# EAGLE design tube_clock_shield_v1 (EAGLE 6.3)
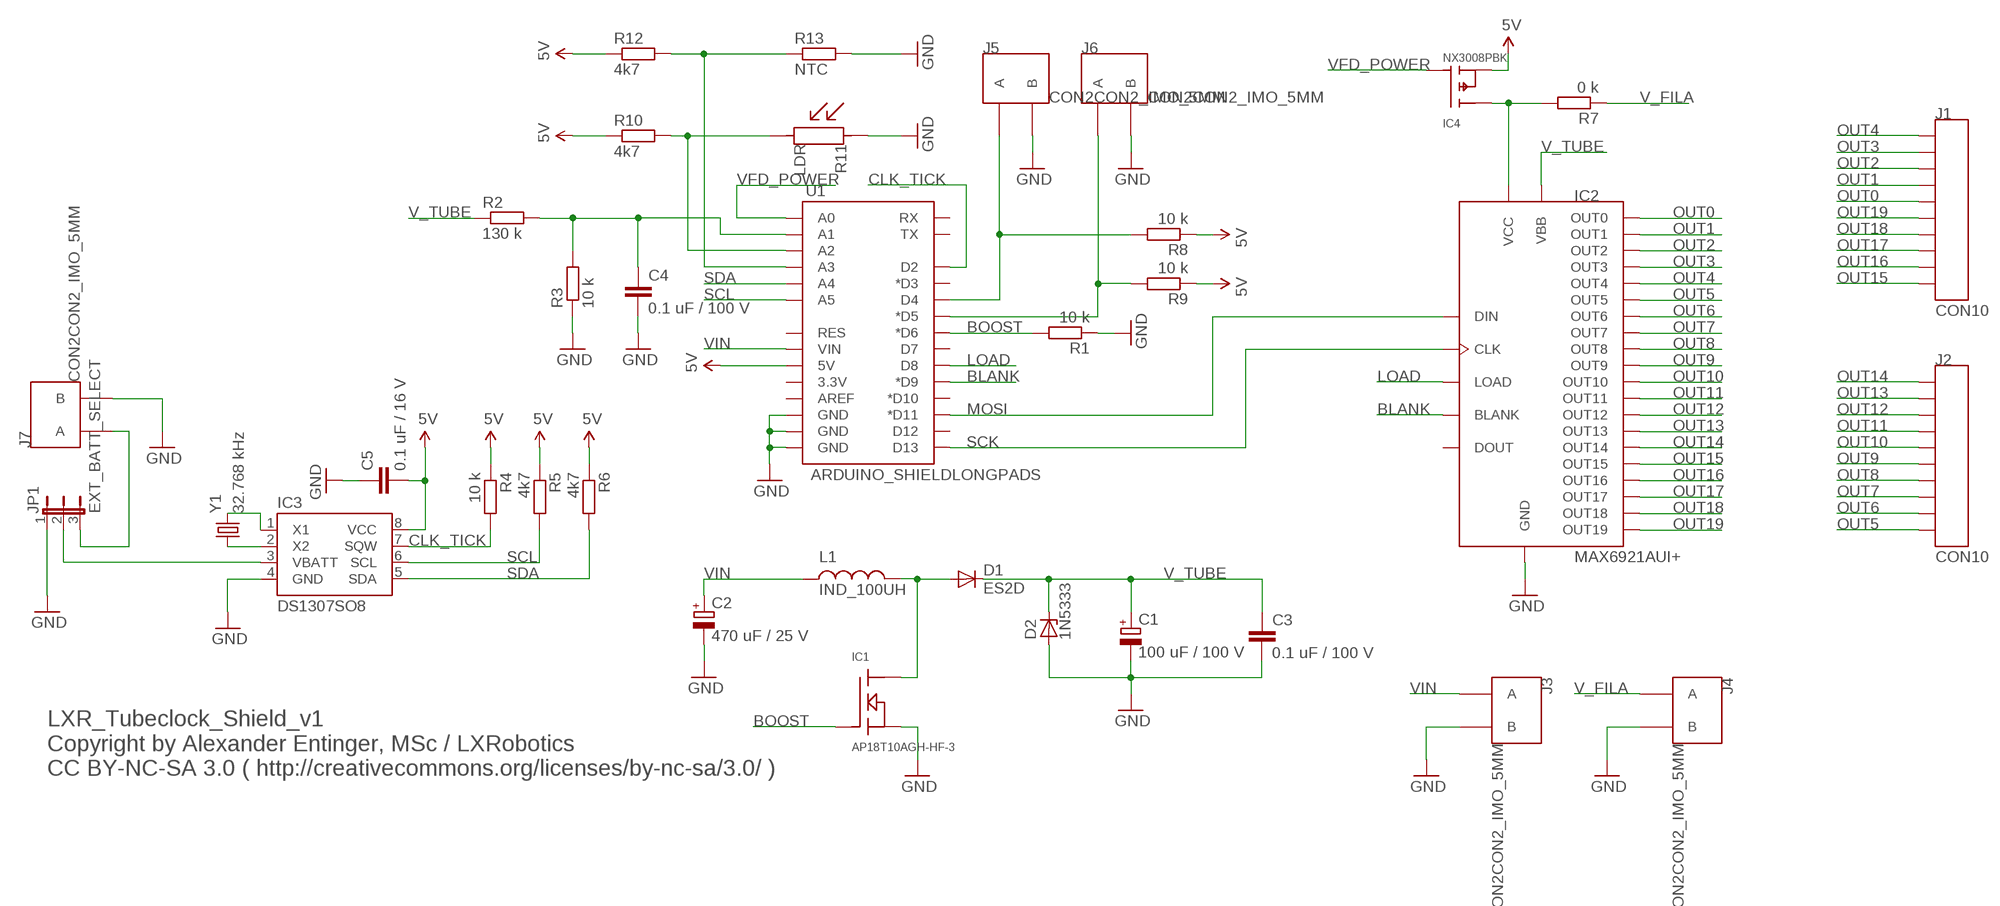
[diagram p0: schematic, sheet 1]

## Parts
C1  100 uF / 100 V  CPOL-EUE5-10.5  [E5-10,5]
C2  470 uF / 25 V  CPOL-EUE5-10.5  [E5-10,5]
C3  0.1 uF / 100 V  C-EUC0805  [C0805]
C4  0.1 uF / 100 V  C-EUC0805  [C0805]
C5  0.1 uF / 16 V  C-EUC0805  [C0805]
D1  ES2D  [SMB]
D2  1N5333  [C1702-15]
IC1  AP18T10AGH-HF-3  [TO252]
IC2  MAX6921AUI+  [TSSOP28]
IC3  DS1307SO8  [SO08]
IC4  NX3008PBK  [SOT23]
J1  CON10  [CON10]
J2  CON10  [CON10]
J3  CON2CON2_IMO_5MM  [CON2_IMO]
J4  CON2CON2_IMO_5MM  [CON2_IMO]
J5  CON2CON2_IMO_5MM  [CON2_IMO]
J6  CON2CON2_IMO_5MM  [CON2_IMO]
J7  CON2CON2_IMO_5MM  [CON2_IMO]
JP1  EXT_BATT_SELECT  JP2E  [JP2]
L1  IND_100UH  [LEISTUNGS_INDUKTIVITAET_PACKAGE]
R1  10 k  R-EU_R0805  [R0805]
R2  130 k  R-EU_R0805  [R0805]
R3  10 k  R-EU_R0805  [R0805]
R4  10 k  R-EU_R0805  [R0805]
R5  4k7  R-EU_R0805  [R0805]
R6  4k7  R-EU_R0805  [R0805]
R7  0 k  R-EU_R0805  [R0805]
R8  10 k  R-EU_R0805  [R0805]
R9  10 k  R-EU_R0805  [R0805]
R10  4k7  R-EU_R0805  [R0805]
R11  LDR  [LDR]
R12  4k7  R-EU_R0805  [R0805]
R13  NTC  R-EU_R0805  [R0805]
U1  ARDUINO_SHIELDLONGPADS  [DUEMILANOVE_SHIELD_LONGPADS]
Y1  32.768 kHz  CRYSTALTC26H_EZ  [TC26HEZ]

## Nets
5V: C5.2 IC3.8(VCC) IC4.2(S) R4.1 R5.1 R6.1 R8.1 R9.1 R10.1 R12.1 U1.5V
BLANK: IC2.20(BLANK) U1.D9(*D9)
BOOST: IC1.G R1.2 U1.D6(*D6)
CLK_TICK: IC3.7(SQW) R4.2 U1.D2
EXT_BATT: J7.P$1(A) JP1.3
GND: C1.- C2.- C3.2 C4.2 C5.1 D2.A IC1.S IC2.21(GND) IC3.4(GND) J3.P$2(B) J4.P$2(B) J5.P$2(B) J6.P$2(B) J7.P$2(B) JP1.1 R1.1 R3.1 R11.P$1 R13.2 U1.GND@0(GND) U1.GND@1(GND) U1.GND@2(GND)
LOAD: IC2.23(LOAD) U1.D8
MOSI: IC2.6(DIN) U1.D11(*D11)
N$1: D1.A IC1.D L1.P$2
N$2: C4.1 R2.2 R3.2 U1.A1
N$4: IC3.2(X2) Y1.1
N$5: IC3.1(X1) Y1.2
N$6: IC2.7(VCC) IC4.3(D) R7.2
N$27: J6.P$1(A) R9.2 U1.D5(*D5)
N$28: IC3.3(VBATT) JP1.2
N$29: J5.P$1(A) R8.2 U1.D4
N$30: R10.2 R11.P$2 U1.A2
N$31: R12.2 R13.1 U1.A3
OUT0: IC2.5(OUT0) J1.P$5
OUT1: IC2.4(OUT1) J1.P$4
OUT2: IC2.3(OUT2) J1.P$3
OUT3: IC2.2(OUT3) J1.P$2
OUT4: IC2.1(OUT4) J1.P$1
OUT5: IC2.28(OUT5) J2.P$10
OUT6: IC2.27(OUT6) J2.P$9
OUT7: IC2.26(OUT7) J2.P$8
OUT8: IC2.25(OUT8) J2.P$7
OUT9: IC2.24(OUT9) J2.P$6
OUT10: IC2.19(OUT10) J2.P$5
OUT11: IC2.18(OUT11) J2.P$4
OUT12: IC2.17(OUT12) J2.P$3
OUT13: IC2.16(OUT13) J2.P$2
OUT14: IC2.15(OUT14) J2.P$1
OUT15: IC2.14(OUT15) J1.P$10
OUT16: IC2.13(OUT16) J1.P$9
OUT17: IC2.12(OUT17) J1.P$8
OUT18: IC2.11(OUT18) J1.P$7
OUT19: IC2.10(OUT19) J1.P$6
SCK: IC2.22(CLK) U1.D13
SCL: IC3.6(SCL) R5.2 U1.A5
SDA: IC3.5(SDA) R6.2 U1.A4
V_FILA: J4.P$1(A) R7.1
V_TUBE: C1.+ C3.1 D1.C D2.C IC2.8(VBB) R2.1
VFD_POWER: IC4.1(G) U1.A0
VIN: C2.+ J3.P$1(A) L1.P$1 U1.VIN
Unconnected: IC2.9(DOUT) U1.3.3V U1.AREF U1.D3(*D3) U1.D7 U1.D10(*D10) U1.D12 U1.RES U1.RX U1.TX

## Notes on the sheet
- LXR_Tubeclock_Shield_v1
  Copyright by Alexander Entinger, MSc / LXRobotics
  CC BY-NC-SA 3.0 ( http://creativecommons.org/licenses/by-nc-sa/3.0/ )

## Library data of the parts
C1 C2 = lxrobotics:CPOL-EU: POLARIZED CAPACITOR, European symbol
C3-C5 = resistor:C-EU: CAPACITOR, European symbol
D1 = diode:ES2D: DIODE super fast rectifier, 2 A
D2 = diode:1N5333: Z DIODE 3.3 V, 5W, 5 percent (Motorola)
IC1 = lxrobotics:AP18T10AGH-HF-3
IC2 = maxim:MAX6921AUI+
IC3 = SparkFun-FreqCtrl:DS1307: I2C real-time clock with battery backup.
IC4 = lxrobotics:NX3008PBK
J1 J2 = lxrobotics:CON10
J3-J7 = lxrobotics:CON2
JP1 = jumper:JP2E: JUMPER
L1 = lxrobotics:IND_100UH
R1-R10 R12 R13 = resistor:R-EU_: RESISTOR, European symbol
R11 = lxrobotics:LDR
U1 = SparkFun-Boards:ARDUINO_SHIELD: Arduino shield footprint
Y1 = SparkFun-FreqCtrl:CRYSTAL: Various standard crystals. Proven footprints. Spark Fun Electronics SKU : COM-00534

## Board
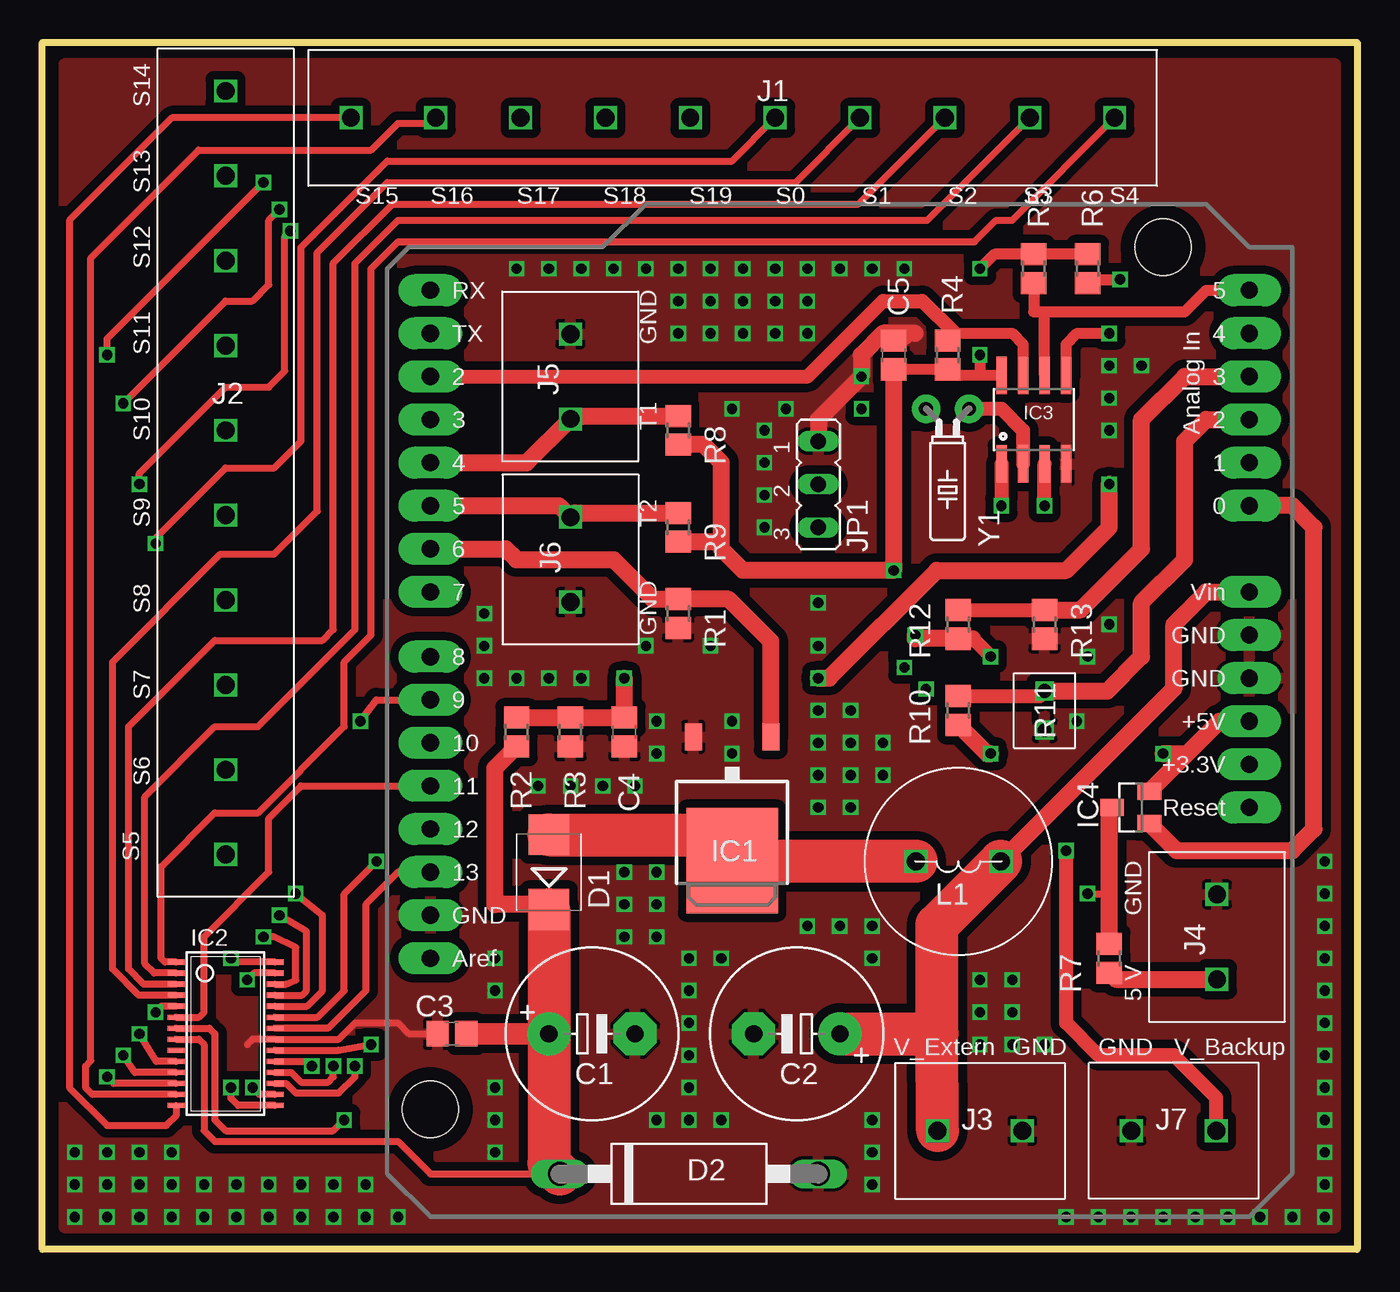
[diagram p1: board, top side]
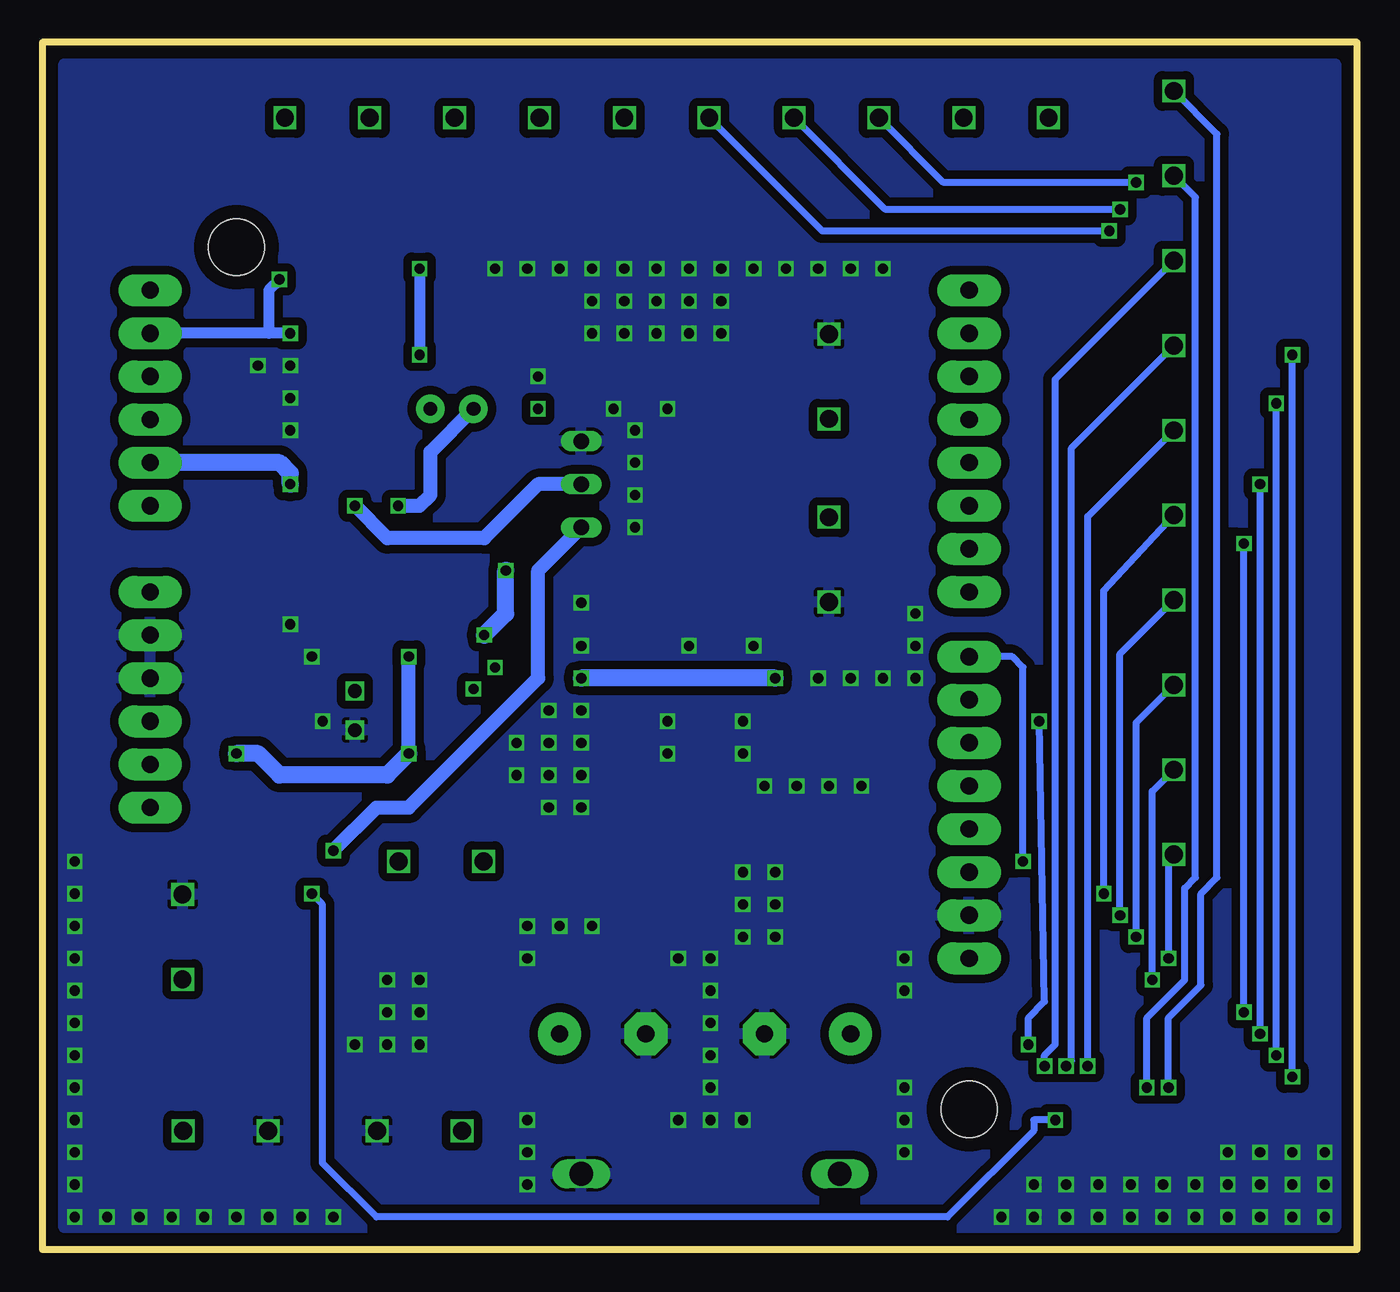
[diagram p2: board, bottom side, seen from below]

Size 77.47 x 71.12 mm. Coordinates in mm from the lower left corner, seen from the top.
Outline: 77.47,0 0,0 0,71.12 77.47,71.12 77.47,0
Copper layers (1*16): Top 0.035mm / dielectric 1.5mm / Bottom 0.035mm
Design rules "LeitOn - Standard-Eagle-DRU - 1- und  2-Lagen DK - deutsch - Rev 2.0": minimum track width 0.15mm, minimum drill 0.3mm, track to track 0.15mm, track to pad 0.15mm, pad to pad 0.15mm, via to via 0.15mm, smd to smd 0.15mm, copper to edge 0.3mm, drill to drill 0.3mm, minimum pad ring 0.15mm, minimum via ring 0.15mm, stop-mask expansion 0.075mm, vias tented up to drill 0mil, thermal gap 0.2mm

### Footprints (pad centres in the part's own frame; a part is rotated, then mirrored left to right if it is on the bottom)
E5-10,5 = drill 1.016 pad 2.54: + -2.54,0 | drill 1.016 pad 2.54 octagon: - 2.54,0
C0805 = smd 1.3 x 1.5: 1 -0.85,0; 2 0.85,0
SMB = smd 2.4 x 2.4: A 2.2,0; C -2.2,0
C1702-15 = drill 1.397 long: A 7.62,0; C -7.62,0
TO252 = smd 5.4 x 6.2: D 0,2.5 | smd 1 x 1.6: G -2.28,-4.8; S 2.28,-4.8
TSSOP28 = smd 0.305 x 0.991: 1 -4.225,-2.918; 2 -3.575,-2.918; 3 -2.925,-2.918; 4 -2.275,-2.918; 5 -1.625,-2.918; 6 -0.975,-2.918; 7 -0.325,-2.918; 8 0.325,-2.918; 9 0.975,-2.918; 10 1.625,-2.918; 11 2.275,-2.918; 12 2.925,-2.918; 13 3.575,-2.918; 14 4.225,-2.918; 15 4.225,2.918; 16 3.575,2.918; 17 2.925,2.918; 18 2.275,2.918; 19 1.625,2.918; 20 0.975,2.918; 21 0.325,2.918; 22 -0.325,2.918; 23 -0.975,2.918; 24 -1.625,2.918; 25 -2.275,2.918; 26 -2.925,2.918; 27 -3.575,2.918; 28 -4.225,2.918
SO08 = smd 0.61 x 2.21: 1 -1.905,-2.616; 2 -0.635,-2.616; 3 0.635,-2.616; 4 1.905,-2.616; 5 1.905,2.616; 6 0.635,2.616; 7 -0.635,2.616; 8 -1.905,2.616
SOT23 = smd 1 x 1.4: 1 -0.95,-1.1; 2 0.95,-1.1; 3 0,1.1
CON10 = drill 1.05 square: P$1 -20,0; P$2 -15,0; P$3 -10,0; P$4 -5,0; P$5 0,0; P$6 5,0; P$7 10,0; P$8 15,0; P$9 20,0; P$10 25,0
CON2_IMO = drill 1.05 square: P$1 -2.5,0; P$2 2.5,0
JP2 = drill 0.914 long: 1 -2.54,0; 2 0,0; 3 2.54,0
LEISTUNGS_INDUKTIVITAET_PACKAGE = drill 1.05 square: P$1 -2.5,0; P$2 2.5,0
R0805 = smd 1.3 x 1.5: 1 -0.85,0; 2 0.85,0
LDR = drill 0.8 square: P$1 -1.15,0; P$2 1.15,0
DUEMILANOVE_SHIELD_LONGPADS = drill 1.016 pad 1.88 long: 3.3V 50.8,26.67; 5V 50.8,29.21; A0 50.8,41.91; A1 50.8,44.45; A2 50.8,46.99; A3 50.8,49.53; A4 50.8,52.07; A5 50.8,54.61; AREF 2.54,15.24; D2 2.54,49.53; D3 2.54,46.99; D4 2.54,44.45; D5 2.54,41.91; D6 2.54,39.37; D7 2.54,36.83; D8 2.54,33.02; D9 2.54,30.48; D10 2.54,27.94; D11 2.54,25.4; D12 2.54,22.86; D13 2.54,20.32; GND@0 50.8,31.75; GND@1 50.8,34.29; GND@2 2.54,17.78; RES 50.8,24.13; RX 2.54,54.61; TX 2.54,52.07; VIN 50.8,36.83 | hole 3.302: 45.72,57.15; 2.54,6.35
TC26HEZ = drill 0.813 pad 1.676: 1 -1.27,0; 2 1.27,0

### Placement (x,y rotation side)
C1  32.38,12.7 0 top
C2  44.45,12.7 180 top
C3  24.13,12.7 180 top
C4  34.29,30.48 270 top
C5  50.16,52.7 270 top
D1  29.84,22.23 90 top
D2  38.1,4.45 0 top
IC1  40.64,25.4 180 top
IC2  10.79,12.7 270 top
IC3  58.42,48.9 0 top
IC4  64.14,26.04 90 top
J1  43.18,66.67 180 top
J2  10.79,48.26 270 top
J3  55.24,6.99 0 top
J4  69.22,18.41 90 top
J5  31.11,51.44 90 top
J6  31.11,40.64 270 top
J7  66.67,6.99 180 top
JP1  45.72,45.09 270 top
L1  53.98,22.86 180 top
R1  37.47,37.47 90 top
R2  27.94,30.48 90 top
R3  31.11,30.48 90 top
R4  53.34,52.7 90 top
R5  58.42,57.78 270 top
R6  61.59,57.78 270 top
R7  62.87,17.14 90 top
R8  37.47,48.26 90 top
R9  37.47,42.55 90 top
R10  53.98,31.75 90 top
R11  59.05,31.75 90 top
R12  53.98,36.83 90 top
R13  59.05,36.83 270 top
U1  20.32,1.91 0 top
Y1  53.34,49.53 180 top

### Tracks (layer width: path | path; a pad name or v marks a point on that pad's centre or on a via)
5V  (via drill 0.6)
  Top 0.66: 55.24,51.51 IC3.8 | R6.1 R5.1 56.09,58.63 v55.24,57.78 | v55.24,52.7 55.24,51.51 | C5.2 R4.1 53.68,51.51 55.24,51.51
  Top 0.813: v55.88,34.92 54.83,35.98
  Top 1.016: IC4.2 67.39,29.14 | 67.39,29.14 69.36,31.11 U1.5V | R10.1 55.66,29.21 v55.88,29.21 | v66.04,29.21 67.31,29.21 arc-90 67.39,29.14 | 54.83,35.98 R12.1 51.44,35.98 v51.44,36.2 | 40.01,41.7 40.01,46.35 38.95,47.41 R8.1 | R9.1 40.01,41.7 | C5.2 v50.16,40.01 41.27,40.01 40.01,41.27 40.01,41.7
  Bottom 0.66: v55.24,57.78 v55.24,52.7
  Bottom 0.813: v55.88,29.21 v55.88,34.92
  Bottom 1.016: v55.88,29.21 57.15,27.94 63.5,27.94 64.77,29.21 v66.04,29.21 | v51.44,36.2 50.16,37.47 v50.16,40.01
BLANK  (via drill 0.6)
  Top 0.406: IC2.20 17.44,11.72 v19.37,12.06 | v18.73,31.11 19.68,32.38 U1.D9
  Bottom 0.406: v19.37,12.06 19.37,13.65 18.41,14.61 v18.73,31.11
BOOST
  Top 1.016: U1.D6 27.3,41.27 27.94,40.64 33.66,40.64 35.98,38.31 R1.2 40.42,38.31 42.92,35.82 IC1.G
CLK_TICK
  Top 0.66: R4.2 53.76,53.98 57.15,53.98 57.78,53.34 IC3.7
  Top 0.813: U1.D2 45.09,51.44 49.53,55.88 51.85,55.88 53.76,53.98
EXT_BATT  (via drill 0.6)
  Top 0.813: J7.P$1 69.17,8.93 66.67,11.43 62.23,11.43 60.33,13.34 v60.33,23.5
  Bottom 0.813: v60.33,23.5 57.78,26.04 55.88,26.04 48.26,33.66 48.26,40.01 JP1.3
GND  (via drill 0.6)
  Top 0.406: 12.06,12.06 12.38,12.38 IC2.21 17.45,12.38 18.41,13.34 20.95,13.34 21.59,12.7 C3.2 | C5.1 51.02,53.55 51.44,53.98
  Top 1.016: 51.44,53.98 49.53,53.98 48.26,52.7 v48.26,51.44 45.72,48.9 JP1.1
  other vias: 64.77,52.07 62.87,52.07 62.87,50.16 62.87,48.26 1.91,5.71 3.81,5.71 5.71,5.71 7.62,5.71 19.05,3.81 20.95,1.91 19.05,1.91 17.14,1.91 15.24,1.91 13.34,1.91 11.43,1.91 9.53,1.91 7.62,1.91 5.71,1.91 3.81,1.91 1.91,1.91 1.91,3.81 3.81,3.81 5.71,3.81 7.62,3.81 9.53,3.81 11.43,3.81 13.34,3.81 15.24,3.81 17.14,3.81 60.33,1.91 62.23,1.91 64.14,1.91 66.04,1.91 67.94,1.91 69.85,1.91 71.75,1.91 73.66,1.91 75.56,1.91 75.56,3.81 75.56,5.71 75.56,7.62 75.56,9.53 75.56,11.43 75.56,13.34 75.56,15.24 75.56,17.14 75.56,19.05 75.56,20.95 75.56,22.86 26.67,17.14 26.67,15.24 26.67,9.53 26.67,7.62 26.67,5.71 36.2,7.62 38.1,7.62 40.01,7.62 48.9,7.62 48.9,5.71 48.9,3.81 38.1,9.53 38.1,11.43 38.1,13.34 38.1,15.24 40.01,17.14 38.1,17.14 36.2,18.41 34.29,18.41 36.2,20.32 36.2,22.23 34.29,22.23 34.29,20.32 45.09,19.05 46.99,19.05 48.9,19.05 48.9,17.14 62.87,36.83 61.59,34.92 59.05,12.06 57.15,12.06 55.24,12.06 55.24,13.97 57.15,13.97 57.15,15.88 55.24,15.88 29.21,27.3 31.11,27.3 33.02,27.3 34.92,27.3 36.2,29.21 36.2,31.11 26.04,37.47 26.04,35.56 26.04,33.66 27.94,33.66 29.84,33.66 31.75,33.66 35.56,35.56 39.37,35.56 45.72,38.1 45.72,35.56 45.72,31.75 47.62,31.75 49.53,29.84 47.62,29.84 45.72,29.84 45.72,27.94 47.62,27.94 49.53,27.94 47.62,26.04 45.72,26.04 40.64,29.21 40.64,31.11 60.96,31.11 42.55,42.55 42.55,44.45 42.55,46.35 42.55,48.26 43.81,49.53 40.64,49.53 27.94,57.78 29.84,57.78 31.75,57.78 33.66,57.78 35.56,57.78 37.47,57.78 37.47,55.88 37.47,53.98 39.37,53.98 39.37,55.88 39.37,57.78 41.27,57.78 41.27,55.88 41.27,53.98 43.18,53.98 45.09,53.98 50.8,57.78 48.9,57.78 46.99,57.78 45.09,57.78 45.09,55.88 43.18,55.88 43.18,57.78
  pour Bottom (isolate 0.508): 1.27,1.27 76.2,1.27 76.2,69.85 1.27,69.85
  pour Top (isolate 0.508): 1.27,1.27 76.2,1.27 76.2,69.85 1.27,69.85
LOAD  (via drill 0.6)
  Top 0.406: IC2.23 16.21,13.68 17.78,15.24 17.78,20.95 v19.68,22.86
  Bottom 0.406: v19.68,22.86 19.68,34.29 20.32,34.92 U1.D8
MOSI
  Top 0.406: IC2.6 9.23,13.68 9.53,13.97 9.53,18.41 13.34,22.23 13.34,25.4 15.24,27.3 U1.D11
N$1
  Top 2.54: L1.P$2 40.68,22.86 IC1.D 39.12,24.43 D1.A
N$2  (via drill 0.6)
  Top 1.016: R2.2 R3.2 C4.1 v34.29,33.66 | v45.72,33.66 46.35,33.66 52.7,40.01 60.33,40.01 62.87,42.55 v62.87,45.09
  Bottom 1.016: v34.29,33.66 v45.72,33.66 | v62.87,45.09 62.87,45.72 63.5,46.35 U1.A1
N$4
  Top 0.813: Y1.1 56.52,49.53 57.78,48.26 IC3.2
N$5  (via drill 0.6)
  Top 0.813: IC3.1 v56.52,43.81
  Bottom 0.813: v56.52,43.81 55.24,43.81 54.61,44.45 54.61,46.99 Y1.2
N$6  (via drill 0.6)
  Top 0.406: IC2.7 9.84,13.03 10.16,12.7 10.16,7.62 10.79,6.99 17.14,6.99 v17.78,7.62 | v61.59,20.95 62.87,20.95
  Top 1.016: R7.2 62.87,20.95 62.87,26.04 IC4.3
  Bottom 0.406: v17.78,7.62 19.05,7.62 19.05,6.99 24.13,1.91 57.78,1.91 60.96,5.08 60.96,20.32 v61.59,20.95
N$27
  Top 1.016: U1.D5 30.44,43.81 J6.P$1 31.37,43.4 R9.2
N$28  (via drill 0.6)
  Top 0.813: v59.05,43.81 IC3.3
  Bottom 0.813: JP1.2 48.26,45.09 51.44,41.91 57.15,41.91 v59.05,43.81
N$29
  Top 1.016: U1.D4 28.54,46.35 J5.P$1 31.29,49.11 R8.2
N$30
  Top 0.813: R10.2 58.76,32.6 R11.P$2
  Top 1.016: R11.P$2 62.74,32.9 64.77,34.92 64.77,38.1 67.31,40.64 67.31,47.62 68.58,48.9 U1.A2
N$31
  Top 0.813: R12.2 R13.1
  Top 1.016: R13.1 61.17,37.68 64.77,41.27 64.77,48.9 67.31,51.44 U1.A3
N$46  (via drill 0.6)
  other vias: 50.8,34.29
N$47  (via drill 0.6)
  other vias: 52.07,33.02
N$55  (via drill 0.6)
  other vias: 48.26,49.53
OUT0  (via drill 0.6)
  Top 0.406: IC2.5 7.02,14.32 v6.67,13.97 | v6.67,41.59 6.67,41.91 10.79,46.04 13.65,46.04 15.24,47.62 15.24,59.05 20.32,64.14 40.64,64.14 J1.P$5
  Bottom 0.406: v6.67,13.97 v6.67,41.59
OUT1
  Top 0.406: IC2.4 5.66,14.97 4.13,16.51 4.13,34.61 10.48,40.96 13.65,40.96 16.19,43.5 16.19,58.74 20.32,62.87 44.37,62.87 J1.P$4
OUT2
  Top 0.406: IC2.3 5.96,15.62 5.08,16.51 5.08,30.8 10.16,35.88 16.51,35.88 17.14,36.51 17.14,58.1 20.64,61.59 48.1,61.59 J1.P$3
OUT3
  Top 0.406: IC2.2 6.58,16.27 6.03,16.83 6.03,26.67 10.16,30.8 12.7,30.8 18.41,36.51 18.41,58.1 20.95,60.64 52.15,60.64 J1.P$2
OUT4
  Top 0.406: IC2.1 7.21,16.93 6.99,17.14 6.99,22.54 10.16,25.72 12.7,25.72 17.78,30.8 17.78,34.61 19.37,36.2 19.37,57.78 20.95,59.37 54.93,59.37 56.2,60.64 57.15,60.64 J1.P$1
OUT5  (via drill 0.6)
  Top 0.406: IC2.28 11.33,16.93 v11.11,17.14
  Bottom 0.406: J2.P$10 11.11,22.94 v11.11,17.14
OUT6  (via drill 0.6)
  Top 0.406: IC2.27 12.46,16.27 v12.06,15.88
  Bottom 0.406: v12.06,15.88 12.06,26.99 J2.P$9
OUT7  (via drill 0.6)
  Top 0.406: IC2.26 14.36,15.62 14.92,15.88 14.92,17.78 13.65,18.41 v13.02,18.41
  Bottom 0.406: v13.02,18.41 13.02,31.04 J2.P$8
OUT8  (via drill 0.6)
  Top 0.406: IC2.25 15.29,14.97 15.56,15.24 15.56,18.73 v13.97,19.68
  Bottom 0.406: v13.97,19.68 13.97,35.09 J2.P$7
OUT9  (via drill 0.6)
  Top 0.406: IC2.24 15.6,14.32 16.51,15.24 16.51,19.68 v14.92,20.95
  Bottom 0.406: v14.92,20.95 14.92,38.81 J2.P$6
OUT10  (via drill 0.6)
  Top 0.406: IC2.19 15.6,11.07 v15.88,10.79
  Bottom 0.406: v15.88,10.79 15.88,43.18 J2.P$5
OUT11  (via drill 0.6)
  Top 0.406: IC2.18 14.66,10.43 15.24,9.84 16.83,9.84 17.14,10.16 v17.14,10.79
  Bottom 0.406: v17.14,10.79 16.83,11.11 16.83,47.23 J2.P$4
OUT12  (via drill 0.6)
  Top 0.406: IC2.17 14.36,9.78 14.92,9.21 17.46,9.21 18.41,10.16 v18.41,10.79
  Bottom 0.406: v18.41,10.79 18.41,11.43 17.78,12.06 17.78,51.27 J2.P$3
OUT13  (via drill 0.6)
  Top 0.406: IC2.16 12.78,9.12 v12.38,9.53
  Bottom 0.406: v12.38,9.53 12.38,13.65 10.16,15.88 10.16,21.27 9.53,21.91 9.53,61.99 J2.P$2
OUT14  (via drill 0.6)
  Top 0.406: IC2.15 11.53,8.47 11.11,8.89 v11.11,9.53
  Bottom 0.406: v11.11,9.53 11.11,13.65 9.21,15.56 9.21,20.95 8.26,21.91 8.26,65.72 J2.P$1
OUT15
  Top 0.406: IC2.14 7.88,7.88 7.3,7.3 3.81,7.3 1.59,9.53 1.59,60.64 7.62,66.67 J1.P$10
OUT16
  Top 0.406: IC2.13 2.94,9.12 2.54,9.53 2.54,10.79 2.86,11.11 2.86,58.42 9.21,64.77 19.37,64.77 20.95,66.36 22.86,66.36 J1.P$9
OUT17  (via drill 0.6)
  Top 0.406: IC2.12 4.2,9.78 v3.81,10.16 | v3.81,52.7 3.81,53.66 v13.02,62.87
  Bottom 0.406: v3.81,10.16 v3.81,52.7 | v13.02,62.87 24.37,62.87 J1.P$8
OUT18  (via drill 0.6)
  Top 0.406: IC2.11 5.45,10.43 v4.76,11.43 | v4.76,49.85 10.79,55.88 12.38,55.88 13.34,56.83 13.34,60.64 v13.97,61.28
  Bottom 0.406: v4.76,11.43 v4.76,49.85 | v13.97,61.28 27.78,61.28 J1.P$7
OUT19  (via drill 0.6)
  Top 0.406: IC2.10 6.71,11.07 v5.71,12.7 | v5.71,45.09 5.71,45.72 10.79,50.8 13.34,50.8 14.29,51.75 14.29,59.69 v14.61,60.01
  Bottom 0.406: v5.71,12.7 v5.71,45.09 | v14.61,60.01 31.51,60.01 J1.P$6
SCK
  Top 0.406: U1.D13 20.95,22.23 19.05,20.32 19.05,15.24 16.84,13.03 IC2.22
SCL
  Top 0.66: IC3.6 59.05,55.24 | 59.05,55.24 58.42,55.24 R5.2 | 59.05,55.24 67.31,55.24 68.58,56.52 U1.A5
SDA  (via drill 0.6)
  Top 0.66: IC3.5 60.33,53.34 60.96,53.98 v62.87,53.98 | R6.2 61.81,57.15 v63.5,57.15
  Bottom 0.66: v63.5,57.15 64.14,56.52 64.14,53.98 | v62.87,53.98 64.14,53.98 | 64.14,53.98 U1.A4
V_FILA
  Top 1.016: R7.1 63.24,15.91 J4.P$1
V_TUBE
  Top 0.406: IC2.8 9.21,12.38 9.53,12.06 9.53,6.99 10.16,6.35 20.95,6.35 22.86,4.45 D2.C
  Top 1.016: D1.C 29.55,20.32 26.67,20.32 26.67,28.36 R2.1
  Top 1.27: C1.+ C3.1
  Top 2.54: D2.C 29.84,5.08 C1.+ D1.C
VFD_POWER
  Top 1.016: IC4.1 66.83,23.5 73.66,23.5 74.93,24.77 74.93,42.55 73.66,43.81 U1.A0
VIN
  Top 1.016: L1.P$1 66.67,33.06 66.67,36.83 68.58,38.73 U1.VIN
  Top 2.54: J3.P$1 52.72,12.7 | 52.72,12.7 52.7,17.14 52.7,19.09 L1.P$1 | C2.+ 52.72,12.7

### Text on the board
tNames: S14 | S13 | S15 | S16 | S17 | S18 | S19 | S0 | S1 | S2 | S3 | S4 | S12 | S11 | GND | S10 | T1 | S9 | T2 | S8 | GND | S7 | S6 | S5 | GND | 5 V | V_Extern | GND | GND | V_Backup